# EAGLE design signal_interface_buffer1 (EAGLE 6.5.0)
Signal Interfacing Board
AUTHOR: Pasakorn Tiwatthanont; REV: 1
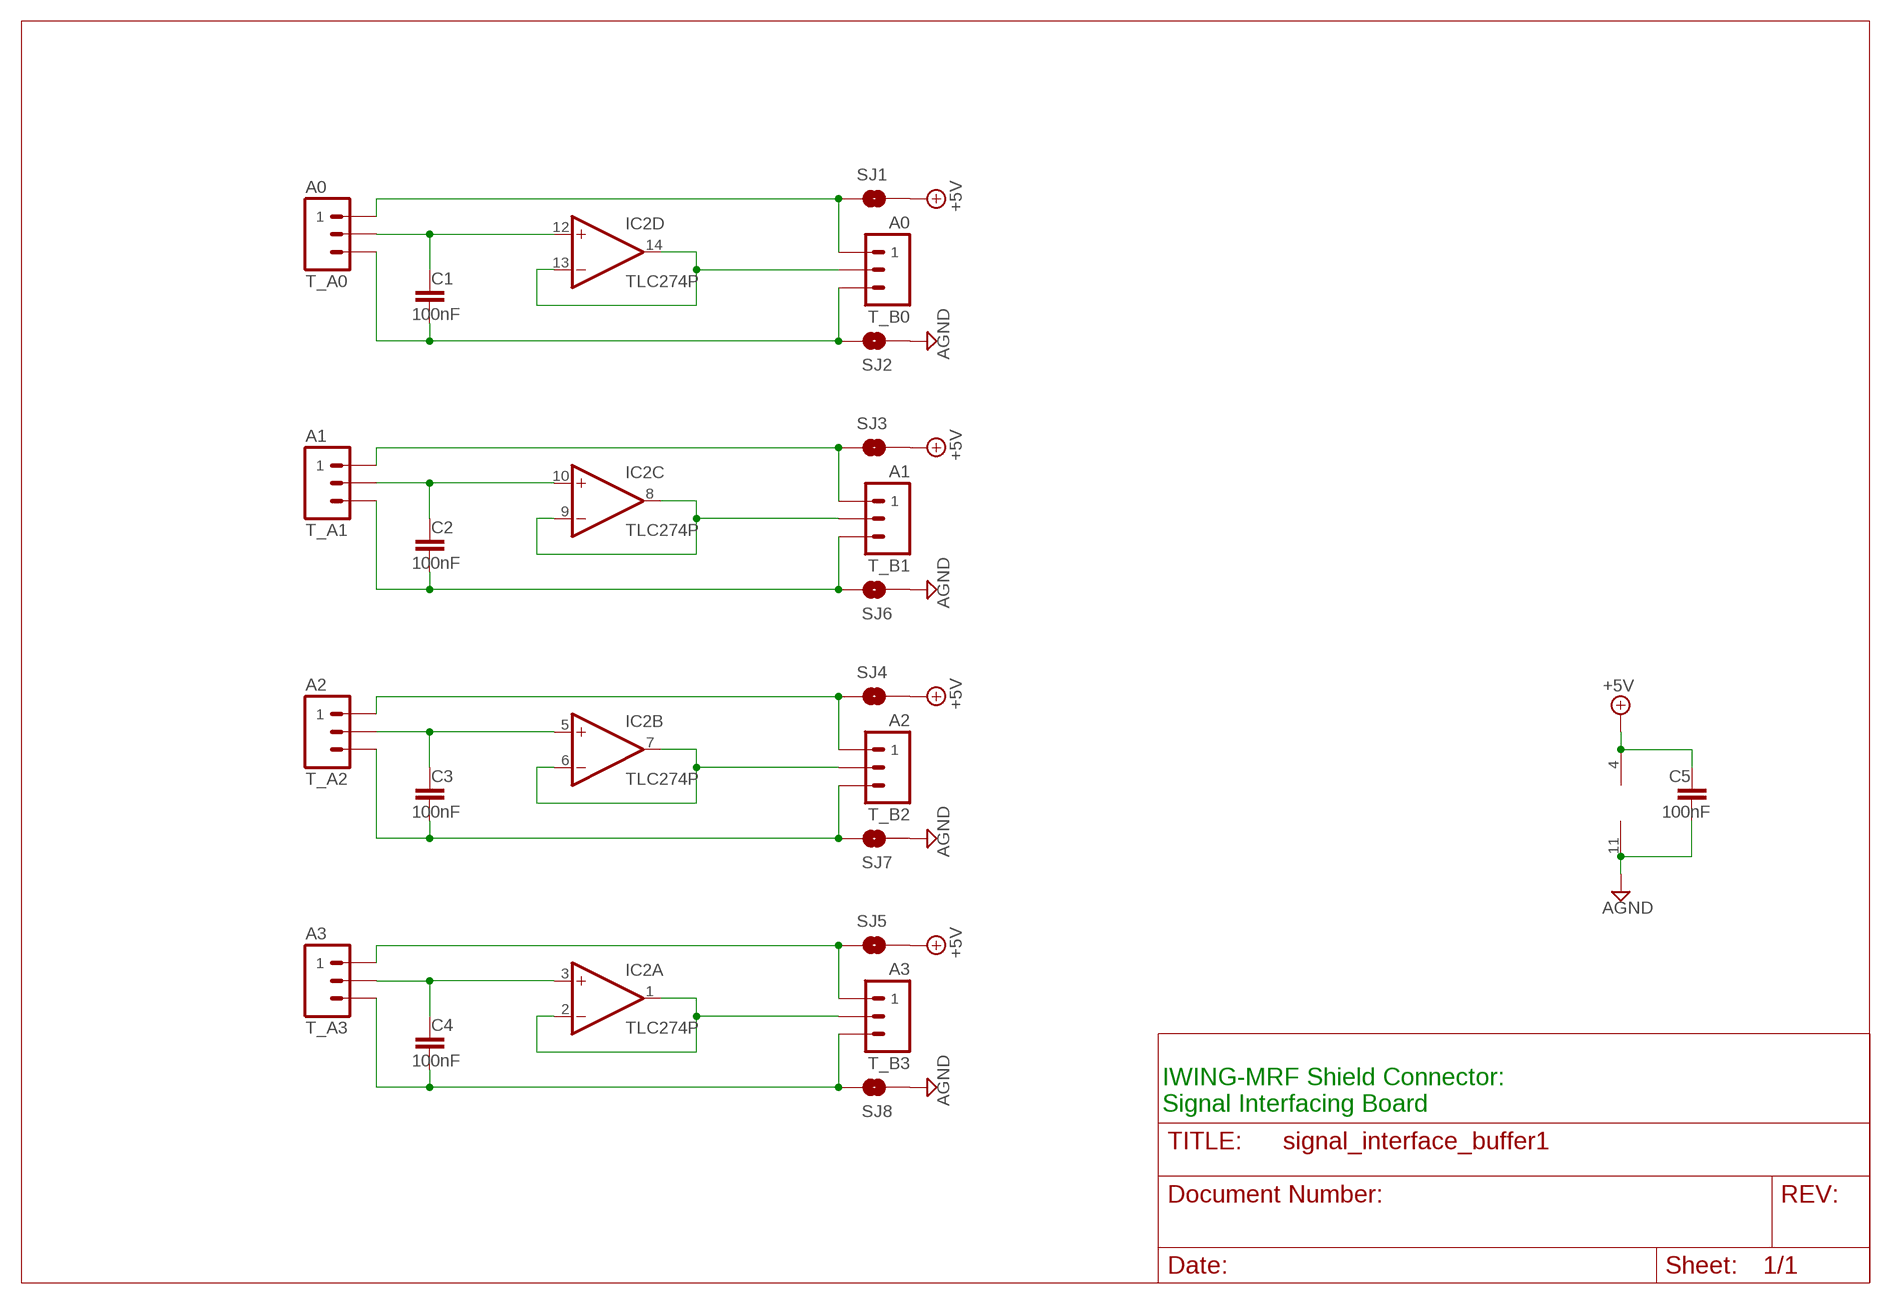
[diagram p0: schematic, sheet 1]

## Parts
C1  100nF  RCL_C-EU050-025X075  [RCL_C050-025X075]
C2  100nF  RCL_C-EU050-025X075  [RCL_C050-025X075]
C3  100nF  RCL_C-EU050-025X075  [RCL_C050-025X075]
C4  100nF  RCL_C-EU050-025X075  [RCL_C050-025X075]
C5  100nF  RCL_C-EU050-025X075  [RCL_C050-025X075]
IC2  TLC274P  [DIL14]
SJ1  SOLDERJUMPERTRACE  [SJ_2S-TRACE]
SJ2  SOLDERJUMPERTRACE  [SJ_2S-TRACE]
SJ3  SOLDERJUMPERTRACE  [SJ_2S-TRACE]
SJ4  SOLDERJUMPERTRACE  [SJ_2S-TRACE]
SJ5  SOLDERJUMPERTRACE  [SJ_2S-TRACE]
SJ6  SOLDERJUMPERTRACE  [SJ_2S-TRACE]
SJ7  SOLDERJUMPERTRACE  [SJ_2S-TRACE]
SJ8  SOLDERJUMPERTRACE  [SJ_2S-TRACE]
T_A0  A0  ST03-3.5MM  [ED350V-03P]
T_A1  A1  ST03-3.5MM  [ED350V-03P]
T_A2  A2  ST03-3.5MM  [ED350V-03P]
T_A3  A3  ST03-3.5MM  [ED350V-03P]
T_B0  A0  ST03-5MM  [EK500V-03P]
T_B1  A1  ST03-5MM  [EK500V-03P]
T_B2  A2  ST03-5MM  [EK500V-03P]
T_B3  A3  ST03-5MM  [EK500V-03P]

## Nets
+5V: C5.1 IC2.4(P:V+) SJ1.2 SJ3.2 SJ4.2 SJ5.2
AGND: C5.2 IC2.11(P:V-) SJ2.1 SJ6.1 SJ7.1 SJ8.1
AIO0: C1.1 IC2.12(D:+IN) T_A0.P$2
AIO1: C2.1 IC2.10(C:+IN) T_A1.P$2
AIO2: C3.1 IC2.5(B:+IN) T_A2.P$2
N$1: C4.2 SJ8.2 T_A3.P$3 T_B3.P$3
N$2: C3.2 SJ7.2 T_A2.P$3 T_B2.P$3
N$3: C2.2 SJ6.2 T_A1.P$3 T_B1.P$3
N$4: C1.2 SJ2.2 T_A0.P$3 T_B0.P$3
N$5: IC2.13(D:-IN) IC2.14(D:OUT) T_B0.P$2
N$6: IC2.8(C:OUT) IC2.9(C:-IN) T_B1.P$2
N$7: IC2.6(B:-IN) IC2.7(B:OUT) T_B2.P$2
N$8: IC2.1(A:OUT) IC2.2(A:-IN) T_B3.P$2
N$9: SJ1.1 T_A0.P$1 T_B0.P$1
N$10: SJ3.1 T_A1.P$1 T_B1.P$1
N$11: SJ4.1 T_A2.P$1 T_B2.P$1
N$12: SJ5.1 T_A3.P$1 T_B3.P$1
N$15: C4.1 IC2.3(A:+IN) T_A3.P$2

## Notes on the sheet
- IWING-MRF Shield Connector:
  Signal Interfacing Board

## Library data of the parts
C1-C5 = ipas:RCL_C-EU: CAPACITOR, European symbol
IC2 = linear:TLC274: OP AMP
SJ1-SJ8 = SparkFun-Passives:SOLDERJUMPER: Solder Jumper Standard SMD solder jumper. Used to automate production. Two varients : Normally Open and Normally Closed are the same, but have different paste layers. NC will have a large amount of paste and should jumper during reflow.
T_A0 T_A1-T_A3 T_B0 T_B1-T_B3 = ipas:ST03: Dinkle® Screw Terminal Block - 3 Way -5MM: EK500V series. Rated at 20A, 300VAC. Cable size: 2mm² Supplier: Altronics P2035A Source: http://www.dinkle.com/upfiles/proter21253708953.pdf -3.5MM: ED350V series. Rated at 10A, 300VAC. Cable size: 1.4mm² Supplier: Altronics P2029 Source: http://www.dinkle.com/upfiles/proter21253714491.pdf

## Net classes
0 default: width 0.254 mm
1 power: width 0.406 mm, clearance 0.203 mm

## Board
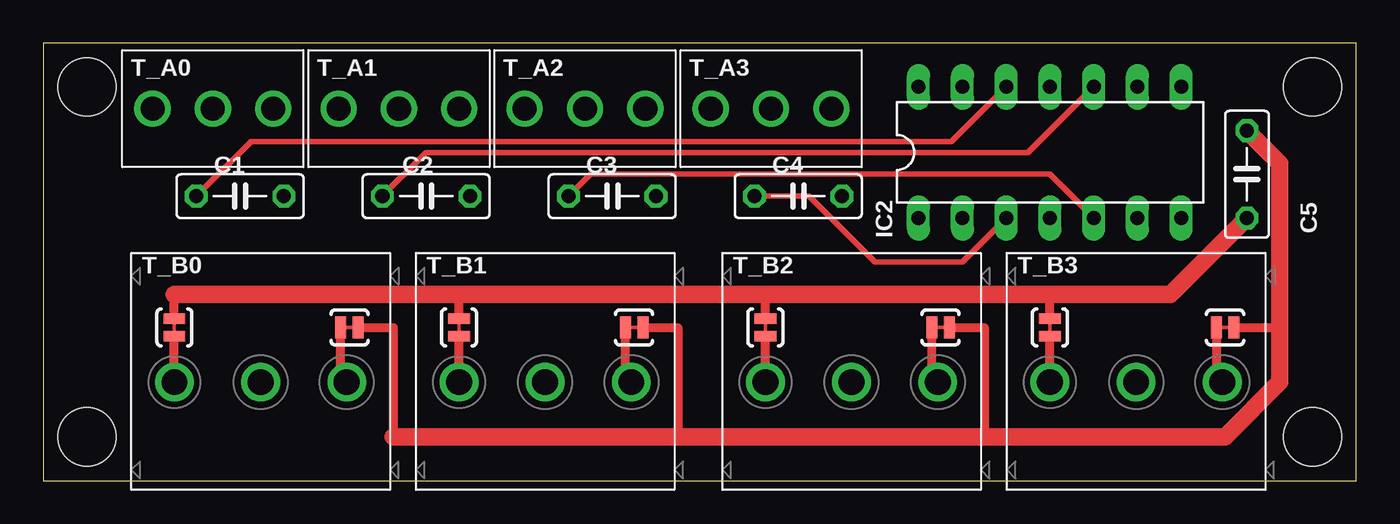
[diagram p1: board, top side]
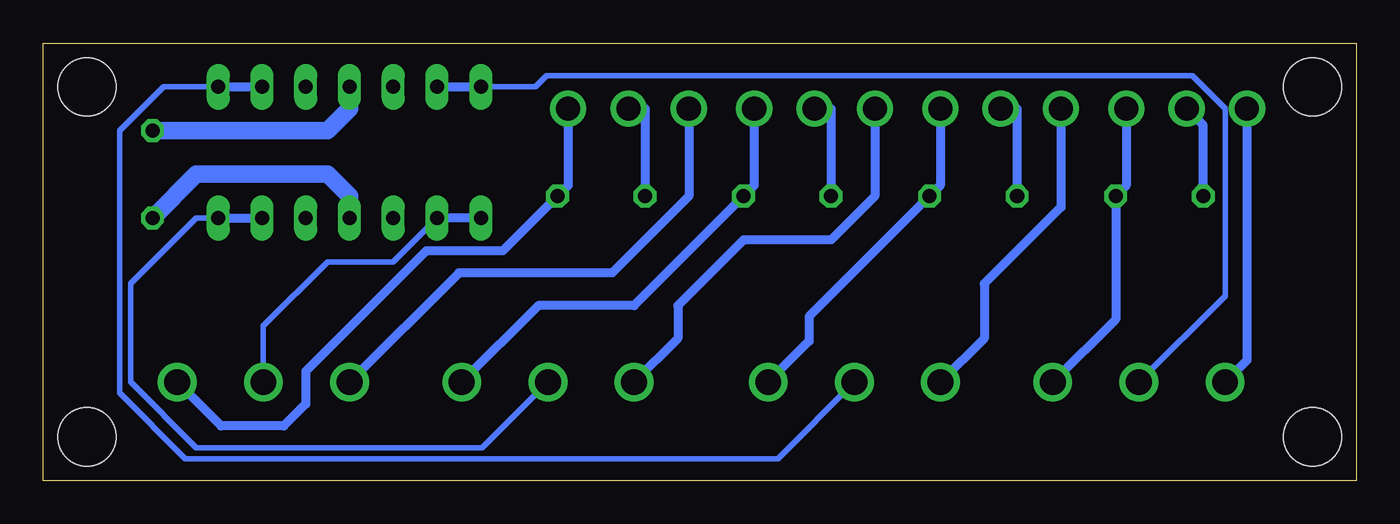
[diagram p2: board, bottom side, seen from below]

Size 76.2 x 25.4 mm. Coordinates in mm from the lower left corner, seen from the top.
Outline: 0,0 76.2,0 76.2,25.4 0,25.4 0,0
Copper layers (1*16): Top 0.035mm / dielectric 1.5mm / Bottom 0.035mm
Design rules "default": minimum track width 10mil, minimum drill 24mil, track to track 8mil, track to pad 8mil, pad to pad 8mil, via to via 8mil, smd to smd 8mil, copper to edge 40mil, drill to drill 8mil, minimum pad ring 10mil, minimum via ring 8mil, stop-mask expansion 4mil, vias tented up to drill 0mil, thermal gap 10mil
Holes 3.35 mm at 2.54,22.86 73.66,22.86 2.54,2.54 73.66,2.54

### Footprints (pad centres in the part's own frame; a part is rotated, then mirrored left to right if it is on the bottom)
RCL_C050-025X075 = drill 0.813 octagon: 1 -2.54,0; 2 2.54,0
DIL14 = drill 0.813 long: 1 -7.62,-3.81; 2 -5.08,-3.81; 3 -2.54,-3.81; 4 0,-3.81; 5 2.54,-3.81; 6 5.08,-3.81; 7 7.62,-3.81; 8 7.62,3.81; 9 5.08,3.81; 10 2.54,3.81; 11 0,3.81; 12 -2.54,3.81; 13 -5.08,3.81; 14 -7.62,3.81
SJ_2S-TRACE = smd 0.635 x 1.27: 1 -0.508,0; 2 0.508,0
ED350V-03P = drill 1.4: P$1 0,0; P$2 3.5,0; P$3 7,0
EK500V-03P = drill 1.5: P$1 0,0; P$2 5,0; P$3 10,0

### Placement (x,y rotation side)
C1  11.43,16.51 0 top
C2  22.23,16.51 0 top
C3  33.02,16.51 0 top
C4  43.81,16.51 0 top
C5  69.85,17.78 90 top
IC2  58.42,19.05 0 top
SJ1  7.62,8.89 90 top
SJ2  17.78,8.89 180 top
SJ3  24.13,8.89 90 top
SJ4  41.91,8.89 90 top
SJ5  58.42,8.89 90 top
SJ6  34.29,8.89 180 top
SJ7  52.07,8.89 180 top
SJ8  68.58,8.89 180 top
T_A0  6.35,21.59 0 top
T_A1  17.14,21.59 0 top
T_A2  27.94,21.59 0 top
T_A3  38.73,21.59 0 top
T_B0  7.62,5.71 0 top
T_B1  24.13,5.71 0 top
T_B2  41.91,5.71 0 top
T_B3  58.42,5.71 0 top

### Tracks (layer width: path | path; a pad name or v marks a point on that pad's centre or on a via)
+5V
  Top 0.508: SJ1.2 7.62,10.8 | SJ5.2 58.42,10.8 | SJ4.2 41.91,10.8 | SJ3.2 24.13,10.8
  Top 1.016: 7.62,10.8 24.13,10.8 41.91,10.8 58.42,10.8 65.41,10.8 C5.1
  Bottom 1.016: C5.1 67.31,17.78 59.69,17.78 58.42,16.51 IC2.4
AGND
  Top 0.508: SJ2.1 20.32,8.89 20.32,2.54 | SJ6.1 36.83,8.89 36.83,2.54 | SJ7.1 54.61,8.89 54.61,2.54 | SJ8.1 71.75,8.89
  Top 1.016: 20.32,2.54 36.83,2.54 54.61,2.54 68.58,2.54 71.75,5.71 71.75,8.89 71.75,18.41 C5.2
  Bottom 1.016: C5.2 59.69,20.32 58.42,21.59 IC2.11
AIO0
  Top 0.305: IC2.12 52.7,19.69 12.06,19.69 C1.1
  Bottom 0.508: C1.1 8.89,20.63 T_A0.P$2
AIO1
  Top 0.305: IC2.10 57.15,19.05 22.23,19.05 C2.1
  Bottom 0.508: T_A1.P$2 19.68,21.59 C2.1
AIO2
  Top 0.305: IC2.5 58.42,17.78 31.75,17.78 C3.1
  Bottom 0.508: T_A2.P$2 30.48,21.59 C3.1
N$1
  Top 0.508: SJ8.2 68.07,6.06 T_B3.P$3
  Bottom 0.508: T_A3.P$3 45.73,17.13 C4.2 49.53,13.34 53.98,13.34 60.96,6.35 60.96,4.45 62.23,3.18 65.88,3.18 T_B3.P$3
N$2
  Top 0.508: T_B2.P$3 51.56,6.06 SJ7.2
  Bottom 0.508: T_A2.P$3 34.94,17.13 C3.2 41.91,10.16 47.47,10.16 T_B2.P$3
N$3
  Top 0.508: T_B1.P$3 33.78,6.06 SJ6.2
  Bottom 0.508: T_A1.P$3 24.14,17.13 C2.2 31.75,9.52 31.75,8.09 T_B1.P$3
N$4
  Top 0.508: T_B0.P$3 17.27,6.06 SJ2.2
  Bottom 0.508: T_A0.P$3 13.35,17.13 C1.2 13.97,9.37 T_B0.P$3
N$5
  Bottom 0.305: T_B0.P$2 7.62,10.72 7.62,21.59 9.53,23.5 46.99,23.5 47.62,22.86 IC2.14
  Bottom 0.508: IC2.13 IC2.14
N$6
  Bottom 0.305: T_B1.P$2 33.58,1.27 67.94,1.27 71.75,5.08 71.75,20.32 69.22,22.86 IC2.8
  Bottom 0.508: IC2.8 IC2.9
N$7
  Bottom 0.305: T_B2.P$2 50.72,1.91 67.31,1.91 71.12,5.71 71.12,11.43 67.31,15.24 IC2.7
  Bottom 0.508: IC2.7 IC2.6
N$8
  Bottom 0.305: T_B3.P$2 63.42,8.97 59.69,12.7 55.88,12.7 IC2.2
  Bottom 0.508: IC2.1 IC2.2
N$9
  Top 0.508: T_B0.P$1 SJ1.1
  Bottom 0.508: T_A0.P$1 6.35,6.98 T_B0.P$1
N$10
  Top 0.508: T_B1.P$1 SJ3.1
  Bottom 0.508: T_A1.P$1 17.14,15.88 21.59,11.43 21.59,8.26 T_B1.P$1
N$11
  Top 0.508: T_B2.P$1 SJ4.1
  Bottom 0.508: T_A2.P$1 27.94,16.51 30.48,13.97 35.56,13.97 39.37,10.16 39.37,8.26 T_B2.P$1
N$12
  Top 0.508: T_B3.P$1 SJ5.1
  Bottom 0.508: T_A3.P$1 38.73,16.51 43.18,12.07 52.07,12.07 T_B3.P$1
N$15
  Top 0.305: C4.1 44.45,16.51 48.26,12.7 53.34,12.7 IC2.3
  Bottom 0.508: T_A3.P$2 41.27,21.59 C4.1